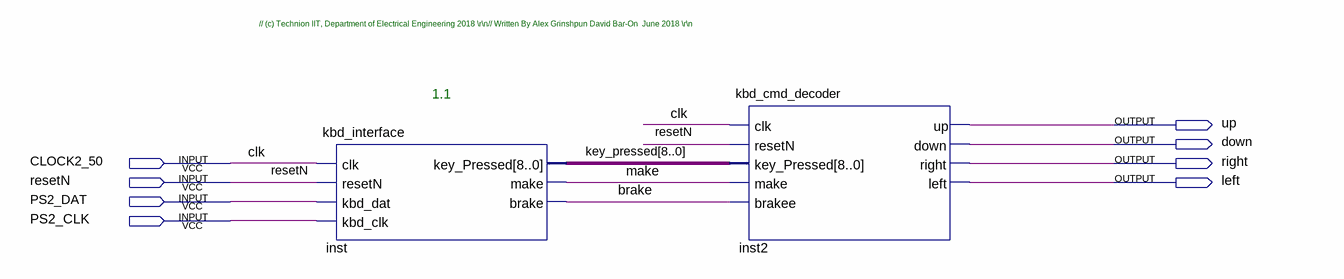
[diagram p0: schematic sheet]
// Quartus schematic TOP_KBD_DEMO.bdf as structural Verilog: 2 symbols, 8 pins
module TOP_KBD_DEMO (
  input  CLOCK2_50,
  input  resetN,
  input  PS2_DAT,
  input  PS2_CLK,
  output up,
  output down,
  output right,
  output left
);

  wire brake, make;
  wire [8:0] key_pressed;

  kbd_interface inst (
    .clk(CLOCK2_50), .resetN(resetN), .kbd_dat(PS2_DAT), .kbd_clk(PS2_CLK), .key_Pressed(key_pressed),
    .make(make), .brake(brake));
  kbd_cmd_decoder inst2 (
    .clk(CLOCK2_50), .resetN(resetN), .key_Pressed(key_pressed), .make(make), .brakee(brake), .up(up),
    .down(down), .right(right), .left(left));

  // Other names for the same wires on the sheet: clk = CLOCK2_50

  // Notes on the sheet:
  //   // (c) Technion IIT, Department of Electrical Engineering 2018 \r\n// Written By Alex Grinshpun David Bar-On  June 2018 \r\n
  //   1.1
endmodule
